# Altium project PIN_CubeSat.PrjPCB (part 2 of 2)

## Sheet CAN_transceiver.SchDoc
size A3; Organization: Altium Limited; Address1: L3, 12a Rodborough Rd; Address2: Frenchs Forest; Address3: NSW; Address4: Australia 2086
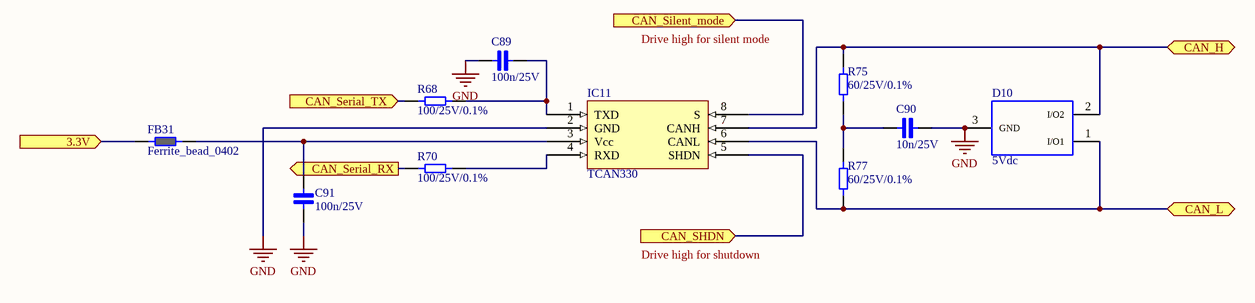
[diagram p11: CAN_transceiver.SchDoc]

### Parts
C89  100n/25V  [Cap_0402]
C90  10n/25V  [Cap_0402]
C91  100n/25V  [Cap_0402]
D10  5Vdc  [WE-TVS_SOT23-3L]
FB31  Ferrite_bead_0402  [FERRITE_0402]
IC11  TCAN330  [SOIC8]
R68  100/25V/0.1%  [RES_0402]
R70  100/25V/0.1%  [RES_0402]
R75  60/25V/0.1%  [RES_1206]
R77  60/25V/0.1%  [RES_1206]

### Ports
3.3V (in), CAN_H (bidir), CAN_L (bidir), CAN_Serial_RX (out), CAN_Serial_TX (in), CAN_SHDN (in), CAN_Silent_mode (in)

### Nets
GND: C89.1 C90.2 C91.1 D10.3(GND) IC11.2(GND)
3.3V: FB31.1 ; port 3.3V
CAN_H: D10.2(I/O2) IC11.7(CANH) R75.2 ; port CAN_H
CAN_L: D10.1(I/O1) IC11.6(CANL) R77.1 ; port CAN_L
CAN_Serial_RX: R70.1 ; port CAN_Serial_RX
CAN_Serial_TX: R68.1 ; port CAN_Serial_TX
CAN_SHDN: IC11.5(SHDN) ; port CAN_SHDN
CAN_Silent_mode: IC11.8(S) ; port CAN_Silent_mode
NetC89_2: C89.2 IC11.1(TXD) R68.2
NetC90_1: C90.1 R75.1 R77.2
NetC91_2: C91.2 FB31.2 IC11.3(Vcc)
NetIC11_4: IC11.4(RXD) R70.2

### Notes on the sheet
- Drive high for silent mode
- Drive high for shutdown
- Title
- Size:
- Date:
- A3
- Number:
- Time:
- Revision:
- Sheet
- of
- File:

### Library data of the parts
C89 C91 = Cap_0402_100n: as C3 on sheet Preamplifier; ComponentLink1Description: New link; ComponentLink1URL: https://www.we-online.com/catalog/en/WCAP-CSGP-25VDC
C90 = Cap_0402_10n: as C32 on sheet General_design; ComponentLink1Description: New link; ComponentLink1URL: https://www.we-online.com/catalog/en/WCAP-CSGP-25VDC
D10 = 824022: WE-TVS TVS Diode - Standard Series, SOT23-3L, 2Channel, 5Vdc; Manufacturer: Wurth Elektronik; Reverse Breakdown Voltage min.: 6.1V; Channel: 2; Channel Input Capacitance: 12pF; Reverse Peak Pulse Current: 8A; Reverse Channel Leakage Current: 2.5uA; DC Operating Voltage: 5V; ComponentLink1Description: Manufacturer; ComponentLink1URL: http://www.we-online.de; ComponentLink2Description: Datasheet; ComponentLink2URL: https://www.we-online.com/catalog/datasheet/824022.pdf; Manufacturer Part Number: 824022; Published Date: April 2020; Size: SOT23-3L; Operating Temperature: -55 to +125degC; Mounting Technology: SMT; Packaging: Tape and Reel
FB31 = Ferrite_bead_0402: Ferrite bead, wurth 74269241102
IC11 = TCAN330: CAN transceiver, 3,3V
R68 R70 = Res_0402_100: Vishay, thin film resistor 100/25V/0.1%
R75 R77 = Res_1206_60: Vishay, thin film resistor 60/25V/0.1%

## Sheet MRAM.SchDoc
size A3; Organization: Altium Limited; Address1: L3, 12a Rodborough Rd; Address2: Frenchs Forest; Address3: NSW; Address4: Australia 2086
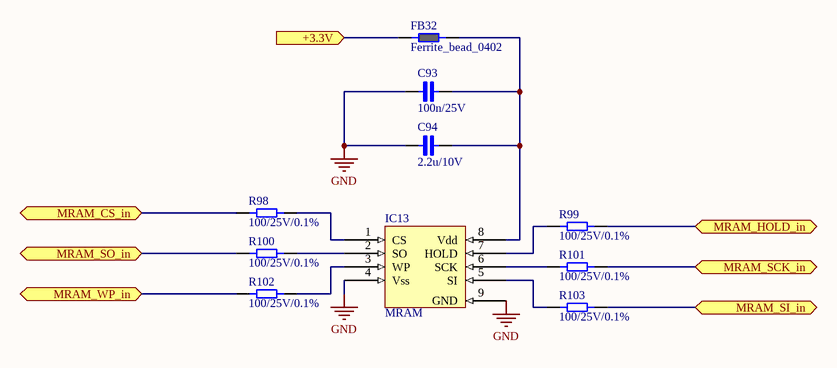
[diagram p12: MRAM.SchDoc]

### Parts
C93  100n/25V  [Cap_0402]
C94  2.2u/10V  [CAP_0603]
FB32  Ferrite_bead_0402  [FERRITE_0402]
IC13  MRAM  [DFN8]
R98  100/25V/0.1%  [RES_0402]
R99  100/25V/0.1%  [RES_0402]
R100  100/25V/0.1%  [RES_0402]
R101  100/25V/0.1%  [RES_0402]
R102  100/25V/0.1%  [RES_0402]
R103  100/25V/0.1%  [RES_0402]

### Ports
+3.3V (in), MRAM_CS_in (bidir), MRAM_HOLD_in (bidir), MRAM_SCK_in (bidir), MRAM_SI_in (bidir), MRAM_SO_in (bidir), MRAM_WP_in (bidir)

### Nets
3.3V: FB32.1 ; port +3.3V
GND: C93.1 C94.1 IC13.4(Vss) IC13.9(GND)
MRAM_CS: R98.1 ; port MRAM_CS_in
MRAM_HOLD: R99.2 ; port MRAM_HOLD_in
MRAM_SCK: R101.2 ; port MRAM_SCK_in
MRAM_SI: R103.2 ; port MRAM_SI_in
MRAM_SO: R100.1 ; port MRAM_SO_in
MRAM_WP: R102.1 ; port MRAM_WP_in
NetC93_2: C93.2 C94.2 FB32.2 IC13.8(Vdd)
NetIC13_1: IC13.1(CS) R98.2
NetIC13_2: IC13.2(SO) R100.2
NetIC13_3: IC13.3(WP) R102.2
NetIC13_5: IC13.5(SI) R103.1
NetIC13_6: IC13.6(SCK) R101.1
NetIC13_7: IC13.7(HOLD) R99.1

### Notes on the sheet
- Title
- Size:
- Date:
- A3
- Number:
- Time:
- Revision:
- Sheet
- of
- File:

### Library data of the parts
C93 = Cap_0402_100n: as C3 on sheet Preamplifier; ComponentLink1Description: New link; ComponentLink1URL: https://www.we-online.com/catalog/en/WCAP-CSGP-25VDC
C94 = Cap_0603_2.2u: Ceramic Capacitor 2.2uF / 0603 / 10V / ±5%, Wurth Elektronik MLCC
FB32 = Ferrite_bead_0402: Ferrite bead, wurth 74269241102
IC13 = MR25H128A: MRAM, 128Kb Serial SPI MRAM, EVERPIN technologies; ComponentLink1Description: New link; ComponentLink1URL: https://pl.mouser.com/datasheet/2/144/MR25H128A_Datasheet-1219034.pdf
R98-R103 = Res_0402_100: Vishay, thin film resistor 100/25V/0.1%

## Sheet LCL_pin_bias.SchDoc
size A3; Organization: Altium Limited; Address1: L3, 12a Rodborough Rd; Address2: Frenchs Forest; Address3: NSW; Address4: Australia 2086
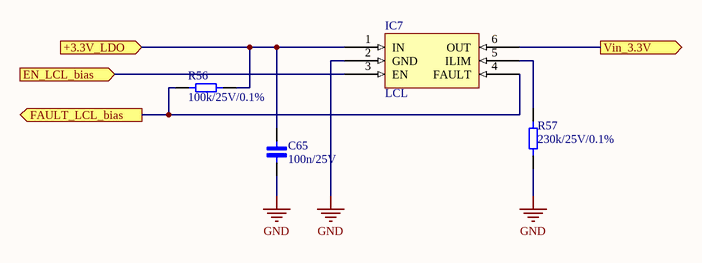
[diagram p13: LCL_pin_bias.SchDoc]

### Parts
C65  100n/25V  [Cap_0402]
IC7  LCL  [SOT-23-6]
R56  100k/25V/0.1%  [RES_0402]
R57  230k/25V/0.1%  [RES_0402]

### Ports
+3.3V_LDO (in), EN_LCL_bias (in), FAULT_LCL_bias (out), Vin_3.3V (out)

### Nets
GND: C65.1 IC7.2(GND) R57.1
+3.3V_LDO: C65.2 IC7.1(IN) R56.1 ; port +3.3V_LDO
EN_LCL_bias: IC7.3(EN) ; port EN_LCL_bias
FAULT_LCL_bias: IC7.4(FAULT) R56.2 ; port FAULT_LCL_bias
Vin_3.3V: IC7.6(OUT) ; port Vin_3.3V
NetIC7_5: IC7.5(ILIM) R57.2

### Notes on the sheet
- Title
- Size:
- Date:
- A3
- Number:
- Time:
- Revision:
- Sheet
- of
- File:

### Library data of the parts
C65 = Cap_0402_100n: as C3 on sheet Preamplifier; ComponentLink1Description: New link; ComponentLink1URL: https://www.we-online.com/catalog/en/WCAP-CSGP-25VDC
IC7 = TPS2553: Latch-off Current Limiter; ComponentLink1Description: New link; ComponentLink1URL: https://www.ti.com/lit/ds/symlink/tps2553.pdf?ts=1603819295065&ref_url=https%253A%252F%252Fwww.google.com%252F
R56 = Res_0402_100k: Vishay, thin film resistor 100k/25V/0.1%
R57 = Res_0402_230k: Vishay, thin film resistor 230k/25V/0.1%

## Sheet prec_5V_LDO.SchDoc
size A3; Organization: Altium Limited; Address1: L3, 12a Rodborough Rd; Address2: Frenchs Forest; Address3: NSW; Address4: Australia 2086
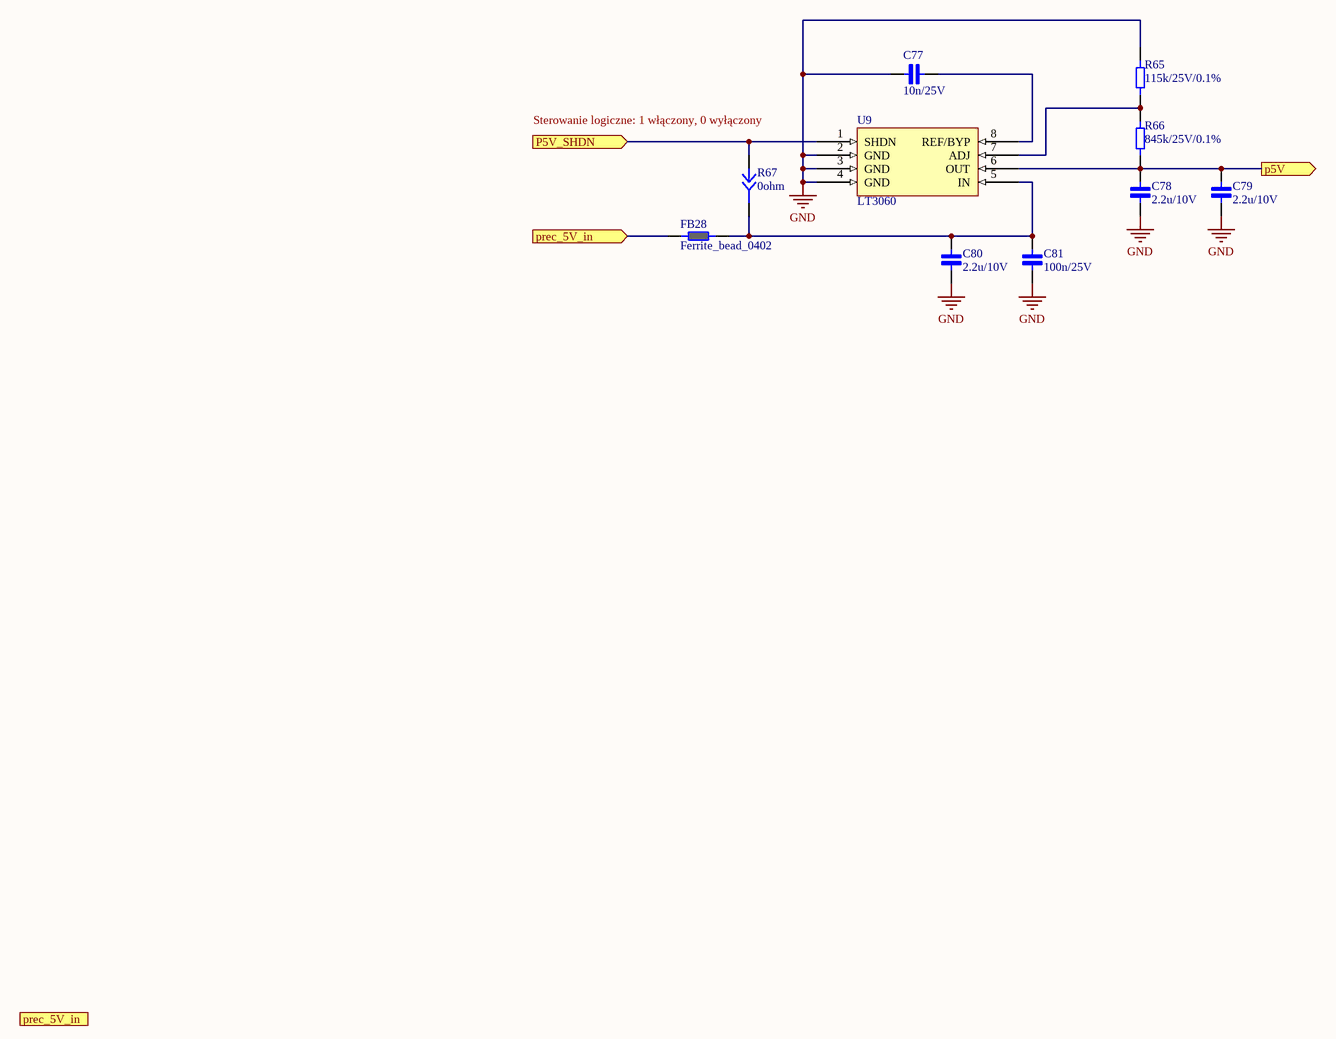
[diagram p14: prec_5V_LDO.SchDoc]

### Parts
(Parts that share a designator on the sheet are numbered #1, #2 ... from top to bottom, then left to right.)
C77  10n/25V  [Cap_0402]
C78  2.2u/10V  [Cap_0402]
C79  2.2u/10V  [Cap_0402]
C80  2.2u/10V  [Cap_0402]
C81  100n/25V  [Cap_0402]
FB28  Ferrite_bead_0402  [FERRITE_0402]
R65  115k/25V/0.1%  [RES_0402]
R66  845k/25V/0.1%  [RES_0402]
R67#1  0ohm  [Jumper 2]
U9  LT3060  [TS8]

### Ports
p5V (out), P5V_SHDN (in), prec_5V_in (in), prec_5V_in (out)

### Nets
GND: C77.2 C78.1 C79.1 C80.1 C81.1 R65.2 U9.2(GND) U9.3(GND) U9.4(GND)
p5V: C78.2 C79.2 R66.1 U9.6(OUT) ; port p5V
P5V_SHDN: R67#1.2 U9.1(SHDN) ; port P5V_SHDN
prec_5V_in: FB28.1 ; port prec_5V_in
NetC77_1: C77.1 U9.8(REF/BYP)
NetC80_2: C80.2 C81.2 FB28.2 R67#1.2 U9.5(IN)
NetR65_1: R65.1 R66.2 U9.7(ADJ)

### Notes on the sheet
- Sterowanie logiczne: 1 włączony, 0 wyłączony
- Title
- Size:
- Date:
- A3
- Number:
- Time:
- Revision:
- Sheet
- of
- File:

### Library data of the parts
C77 = Cap_0402_10n: as C32 on sheet General_design; ComponentLink1Description: New link; ComponentLink1URL: https://www.we-online.com/catalog/en/WCAP-CSGP-25VDC
C78-C80 = Cap_0402_2.2u: Ceramic Capacitor 2.2uF / 0402 / 10V / ±5%, Wurth Elektronik MLCC
C81 = Cap_0402_100n: as C3 on sheet Preamplifier; ComponentLink1Description: New link; ComponentLink1URL: https://www.we-online.com/catalog/en/WCAP-CSGP-25VDC
FB28 = Ferrite_bead_0402: Ferrite bead, wurth 74269241102
R65 = Res_0402_115k: Vishay, thin film resistor 115k/25V/0.1%
R66 = Res_0402_845k: Vishay, thin film resistor 845k/25V/0.1%
R67#1 = Jumper
U9 = Lt3060: 45V VIN, Micropower, / Low Noise, 100mA Low / Dropout, Linear Regulator

## Sheet LCL_12V_prec.SchDoc
size A3; Organization: Altium Limited; Address1: L3, 12a Rodborough Rd; Address2: Frenchs Forest; Address3: NSW; Address4: Australia 2086
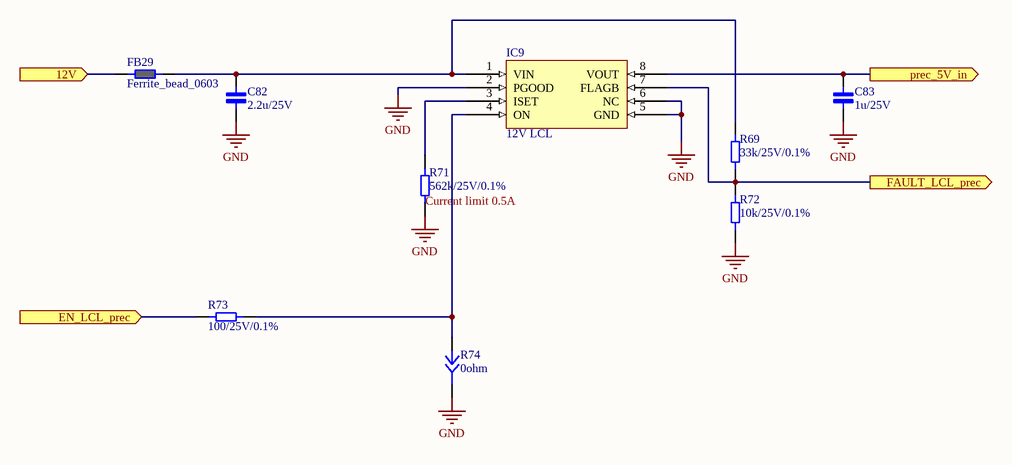
[diagram p15: LCL_12V_prec.SchDoc]

### Parts
(Parts that share a designator on the sheet are numbered #1, #2 ... from top to bottom, then left to right.)
C82  2.2u/25V  [CAP_0603]
C83  1u/25V  [CAP_0603]
FB29  Ferrite_bead_0603  [Ferrite_0603]
IC9  12V LCL  [SO8]
R69  33k/25V/0.1%  [RES_0402]
R71  562k/25V/0.1%  [RES_0402]
R72  10k/25V/0.1%  [RES_0402]
R73  100/25V/0.1%  [RES_0402]
R74#1  0ohm  [Jumper 2]

### Ports
12V (in), EN_LCL_prec (in), FAULT_LCL_prec (out), prec_5V_in (out)

### Nets
12V: FB29.1 ; port 12V
GND: C82.1 C83.1 IC9.2(PGOOD) IC9.5(GND) IC9.6(NC) R71.1 R72.1 R74#1.2
EN_LCL_prec: R73.1 ; port EN_LCL_prec
FAULT_LCL_prec: IC9.7(FLAGB) R69.1 R72.2 ; port FAULT_LCL_prec
prec_5V_in: C83.2 IC9.8(VOUT) ; port prec_5V_in
NetC82_2: C82.2 FB29.2 IC9.1(VIN) R69.2
NetIC9_3: IC9.3(ISET) R71.2
NetIC9_4: IC9.4(ON) R73.2 R74#1.2

### Notes on the sheet
- (near R71) Current limit 0.5A
- Title
- Size:
- Date:
- A3
- Number:
- Time:
- Revision:
- Sheet
- of
- File:

### Library data of the parts
C82 = Cap_0603_2.2u_25v: Ceramic Capacitor 2.2uF / 0603 / 25V / ±5%, Wurth Elektronik MLCC
C83 = Cap_0603_1u_25v: Ceramic Capacitor 1uF / 0603 / 25V / ±5%, Wurth Elektronik MLCC
FB29 = Ferrite_bead_0603: Ferrite bead
IC9 = FPF2700: FPF270xMX
R69 = Res_0402_33k: Vishay, thin film resistor 33k/25V/0.1%
R71 = Res_0402_562k: Vishay, thin film resistor 562k/25V/0.1%
R72 = Res_0402_10k: Vishay, thin film resistor 10k/25V/0.1%
R73 = Res_0402_100: Vishay, thin film resistor 100/25V/0.1%
R74#1 = Jumper

## Sheet LCL_12V_chp.SchDoc
size A3; Organization: Altium Limited; Address1: L3, 12a Rodborough Rd; Address2: Frenchs Forest; Address3: NSW; Address4: Australia 2086
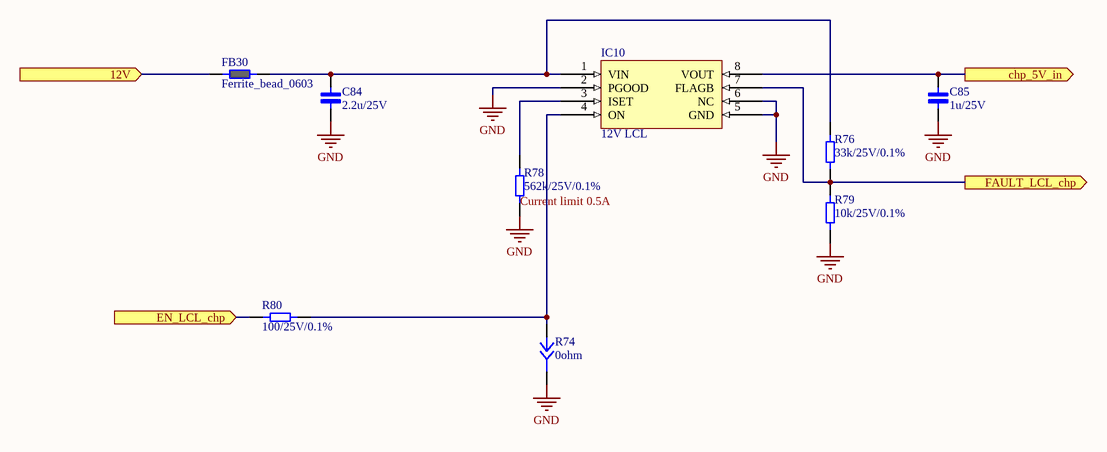
[diagram p16: LCL_12V_chp.SchDoc]

### Parts
(Parts that share a designator on the sheet are numbered #1, #2 ... from top to bottom, then left to right.)
C84  2.2u/25V  [CAP_0603]
C85  1u/25V  [CAP_0603]
FB30  Ferrite_bead_0603  [Ferrite_0603]
IC10  12V LCL  [SO8]
R74#2  0ohm  [Jumper 2]
R76  33k/25V/0.1%  [RES_0402]
R78  562k/25V/0.1%  [RES_0402]
R79  10k/25V/0.1%  [RES_0402]
R80  100/25V/0.1%  [RES_0402]

### Ports
12V (in), chp_5V_in (out), EN_LCL_chp (in), FAULT_LCL_chp (out)

### Nets
12V: FB30.1 ; port 12V
GND: C84.1 C85.1 IC10.2(PGOOD) IC10.5(GND) IC10.6(NC) R74#2.2 R78.1 R79.1
CHP_5V_in: C85.2 IC10.8(VOUT) ; port chp_5V_in
EN_LCL_chp: R80.2 ; port EN_LCL_chp
FAULT_LCL_chp: IC10.7(FLAGB) R76.1 R79.2 ; port FAULT_LCL_chp
NetC84_2: C84.2 FB30.2 IC10.1(VIN) R76.2
NetIC10_3: IC10.3(ISET) R78.2
NetIC10_4: IC10.4(ON) R74#2.1 R80.1

### Notes on the sheet
- (near R78) Current limit 0.5A
- Title
- Size:
- Date:
- A3
- Number:
- Time:
- Revision:
- Sheet
- of
- File:

### Library data of the parts
C84 = Cap_0603_2.2u_25v: as C82 on sheet LCL_12V_prec
C85 = Cap_0603_1u_25v: as C83 on sheet LCL_12V_prec
FB30 = Ferrite_bead_0603: Ferrite bead
IC10 = FPF2700: FPF270xMX
R74#2 = Mini jumper
R76 = Res_0402_33k: Vishay, thin film resistor 33k/25V/0.1%
R78 = Res_0402_562k: Vishay, thin film resistor 562k/25V/0.1%
R79 = Res_0402_10k: Vishay, thin film resistor 10k/25V/0.1%
R80 = Res_0402_100: Vishay, thin film resistor 100/25V/0.1%

## Sheet Dual_signal_switch.SchDoc
size A3; Organization: Altium Limited; Address1: L3, 12a Rodborough Rd; Address2: Frenchs Forest; Address3: NSW; Address4: Australia 2086
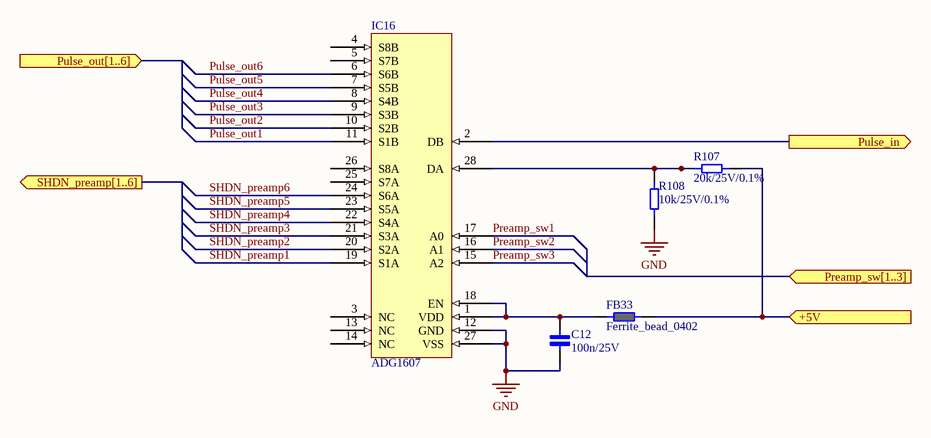
[diagram p17: Dual_signal_switch.SchDoc]

### Parts
C12  100n/25V  [Cap_0402]
FB33  Ferrite_bead_0402  [FERRITE_0402]
IC16  ADG1607  [TSOP28]
R107  20k/25V/0.1%  [RES_0402]
R108  10k/25V/0.1%  [RES_0402]

### Ports
+5V (in), Preamp_sw[1..3] (in), Pulse_in (out), Pulse_out[1..6] (in), SHDN_preamp[1..6] (out)

### Nets
+5: FB33.2 R107.2 ; port +5V
GND: C12.1 IC16.12(GND) IC16.27(VSS) R108.1
Preamp_sw1: IC16.17(A0)
Preamp_sw2: IC16.16(A1)
Preamp_sw3: IC16.15(A2)
Pulse_in: IC16.2(DB) ; port Pulse_in
Pulse_out1: IC16.11(S1B)
Pulse_out2: IC16.10(S2B)
Pulse_out3: IC16.9(S3B)
Pulse_out4: IC16.8(S4B)
Pulse_out5: IC16.7(S5B)
Pulse_out6: IC16.6(S6B)
SHDN_preamp1: IC16.19(S1A)
SHDN_preamp2: IC16.20(S2A)
SHDN_preamp3: IC16.21(S3A)
SHDN_preamp4: IC16.22(S4A)
SHDN_preamp5: IC16.23(S5A)
SHDN_preamp6: IC16.24(S6A)
NetC12_2: C12.2 FB33.1 IC16.1(VDD) IC16.18(EN)
NetIC16_28: IC16.28(DA) R107.1 R108.2

Not connected (* = marked no-connect by the designer): IC16 3(NC) 4(S8B) 5(S7B) 13(NC) 14(NC) 25(S7A) 26(S8A)

### Notes on the sheet
- Title
- Size:
- Date:
- A3
- Number:
- Time:
- Revision:
- Sheet
- of
- File:

### Library data of the parts
C12 = Cap_0402_100n: as C3 on sheet Preamplifier; ComponentLink1Description: New link; ComponentLink1URL: https://www.we-online.com/catalog/en/WCAP-CSGP-25VDC
FB33 = Ferrite_bead_0402: Ferrite bead, wurth 74269241102
IC16 = ADG1607: 8-ch MUX; ComponentLink1Description: New link; ComponentLink1URL: https://pl.mouser.com/datasheet/2/609/ADG1606_1607-1502923.pdf
R107 = Res_0402_20k: Vishay, thin film resistor 20k/25V/0.1%
R108 = Res_0402_10k: Vishay, thin film resistor 10k/25V/0.1%

## Sheet MCU_LDO.SchDoc
size A3; Organization: Altium Limited; Address1: L3, 12a Rodborough Rd; Address2: Frenchs Forest; Address3: NSW; Address4: Australia 2086
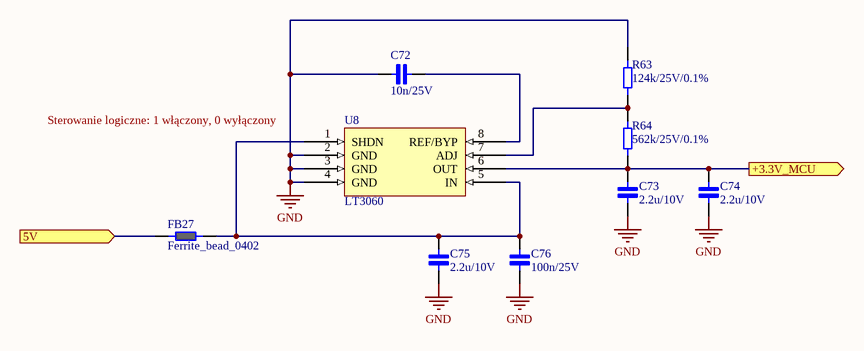
[diagram p18: MCU_LDO.SchDoc]

### Parts
C72  10n/25V  [Cap_0402]
C73  2.2u/10V  [Cap_0402]
C74  2.2u/10V  [Cap_0402]
C75  2.2u/10V  [Cap_0402]
C76  100n/25V  [Cap_0402]
FB27  Ferrite_bead_0402  [FERRITE_0402]
R63  124k/25V/0.1%  [RES_0402]
R64  562k/25V/0.1%  [RES_0402]
U8  LT3060  [TS8]

### Ports
5V (in), +3.3V_MCU (out)

### Nets
3.3V: C73.2 C74.2 R64.1 U8.6(OUT) ; port +3.3V_MCU
5V: FB27.1 ; port 5V
GND: C72.1 C73.1 C74.1 C75.1 C76.1 R63.2 U8.2(GND) U8.3(GND) U8.4(GND)
NetC72_2: C72.2 U8.8(REF/BYP)
NetC75_2: C75.2 C76.2 FB27.2 U8.1(SHDN) U8.5(IN)
NetR63_1: R63.1 R64.2 U8.7(ADJ)

### Notes on the sheet
- (near U8) Sterowanie logiczne: 1 włączony, 0 wyłączony
- Title
- Size:
- Date:
- A3
- Number:
- Time:
- Revision:
- Sheet
- of
- File:

### Library data of the parts
C72 = Cap_0402_10n: as C32 on sheet General_design; ComponentLink1Description: New link; ComponentLink1URL: https://www.we-online.com/catalog/en/WCAP-CSGP-25VDC
C73-C75 = Cap_0402_2.2u: as C78 on sheet prec_5V_LDO
C76 = Cap_0402_100n: as C3 on sheet Preamplifier; ComponentLink1Description: New link; ComponentLink1URL: https://www.we-online.com/catalog/en/WCAP-CSGP-25VDC
FB27 = Ferrite_bead_0402: Ferrite bead, wurth 74269241102
R63 = Res_0402_124k: Vishay, thin film resistor 124k/25V/0.1%
R64 = Res_0402_562k: Vishay, thin film resistor 562k/25V/0.1%
U8 = Lt3060: as U9 on sheet prec_5V_LDO

## Sheet LCL_CAN.SchDoc
size A3; Organization: Altium Limited; Address1: L3, 12a Rodborough Rd; Address2: Frenchs Forest; Address3: NSW; Address4: Australia 2086
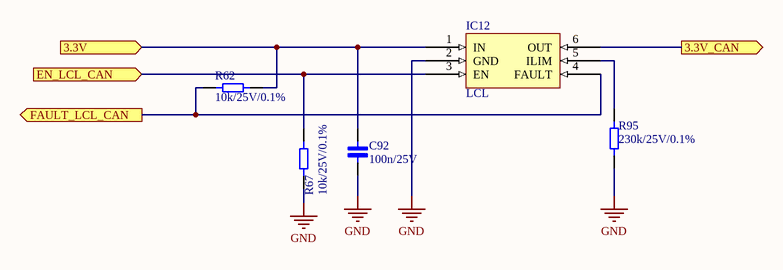
[diagram p19: LCL_CAN.SchDoc]

### Parts
(Parts that share a designator on the sheet are numbered #1, #2 ... from top to bottom, then left to right.)
C92  100n/25V  [Cap_0402]
IC12  LCL  [SOT-23-6]
R62#2  10k/25V/0.1%  [RES_0402]
R67#2  10k/25V/0.1%  [RES_0402]
R95  230k/25V/0.1%  [RES_0402]

### Ports
3.3V (in), 3.3V_CAN (out), EN_LCL_CAN (in), FAULT_LCL_CAN (out)

### Nets
3.3V: C92.2 IC12.1(IN) R62#2.2 ; port 3.3V
GND: C92.1 IC12.2(GND) R67#2.1 R95.1
3.3V_CAN: IC12.6(OUT) ; port 3.3V_CAN
EN_LCL_CAN: IC12.3(EN) R67#2.2 ; port EN_LCL_CAN
FAULT_LCL_CAN: IC12.4(FAULT) R62#2.1 ; port FAULT_LCL_CAN
NetIC12_5: IC12.5(ILIM) R95.2

### Notes on the sheet
- Title
- Size:
- Date:
- A3
- Number:
- Time:
- Revision:
- Sheet
- of
- File:

### Library data of the parts
C92 = Cap_0402_100n: Ceramic Capacitor 100n / 0402 / 25V / ±5%, Wurth Elektronik MLCC; ComponentLink1Description: New link; ComponentLink1URL: https://www.we-online.com/catalog/en/WCAP-CSGP-25VDC
IC12 = TPS2553: Latch-off Current Limiter; ComponentLink1Description: New link; ComponentLink1URL: https://www.ti.com/lit/ds/symlink/tps2553.pdf?ts=1603819295065&ref_url=https%253A%252F%252Fwww.google.com%252F
R62#2 R67#2 = Res_0402_10k: Vishay, thin film resistor 10k/25V/0.1%
R95 = Res_0402_230k: Vishay, thin film resistor 230k/25V/0.1%

## Sheet LCL_SYM_5V.SchDoc
size A3; Organization: Altium Limited; Address1: L3, 12a Rodborough Rd; Address2: Frenchs Forest; Address3: NSW; Address4: Australia 2086
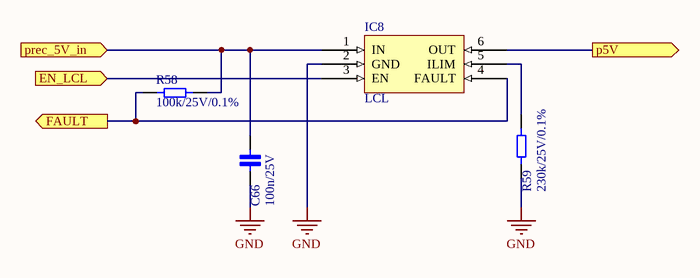
[diagram p20: LCL_SYM_5V.SchDoc]

### Parts
C66  100n/25V  [CAP_0603]
IC8  LCL  [SOT-23-6]
R58  100k/25V/0.1%  [RES_0603]
R59  230k/25V/0.1%  [RES_0603]

### Ports
EN_LCL (in), FAULT (out), p5V (out), prec_5V_in (in)

### Nets
GND: C66.1 IC8.2(GND) R59.2
EN_LCL: IC8.3(EN) ; port EN_LCL
FAULT: IC8.4(FAULT) R58.1 ; port FAULT
p5V: IC8.6(OUT) ; port p5V
prec_5V_in: C66.2 IC8.1(IN) R58.2 ; port prec_5V_in
NetIC8_5: IC8.5(ILIM) R59.2

### Notes on the sheet
- Title
- Size:
- Date:
- A3
- Number:
- Time:
- Revision:
- Sheet
- of
- File:

### Library data of the parts
C66 = Cap_0603_100n: Ceramic Capacitor 100n / 0603 / 25V / ±5%, Wurth Elektronik MLCC; ComponentLink1Description: New link; ComponentLink1URL: https://www.we-online.com/catalog/en/WCAP-CSGP-25VDC
IC8 = TPS2553: Latch-off Current Limiter; ComponentLink1Description: New link; ComponentLink1URL: https://www.ti.com/lit/ds/symlink/tps2553.pdf?ts=1603819295065&ref_url=https%253A%252F%252Fwww.google.com%252F
R58 = Res_0603_100k: Vishay, thin film resistor 100k/25V/0.1%
R59 = Res_0603_230k: Vishay, thin film resistor 230k/25V/0.1%

## Sheet Signal_switch.SchDoc
size A3; Organization: Altium Limited; Address1: L3, 12a Rodborough Rd; Address2: Frenchs Forest; Address3: NSW; Address4: Australia 2086
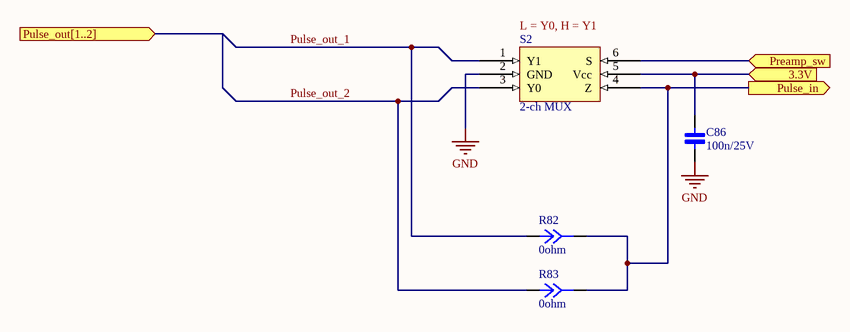
[diagram p21: Signal_switch.SchDoc]

### Parts
C86  100n/25V  [CAP_0603]
R82  0ohm  [Jumper]
R83  0ohm  [Jumper]
S2  2-ch MUX  [TSOP6]

### Ports
3.3V (in), Preamp_sw (in), Pulse_in (out), Pulse_out[1..2] (in)

### Nets
GND: C86.1 S2.2(GND)
3.3V: C86.2 S2.5(Vcc) ; port 3.3V
Preamp_sw: S2.6(S) ; port Preamp_sw
Pulse_in: R82.2 R83.2 S2.4(Z) ; port Pulse_in
Pulse_out_1: R82.2 S2.1(Y1)
Pulse_out_2: R83.2 S2.3(Y0)

### Notes on the sheet
- (near S2) L = Y0, H = Y1
- Title
- Size:
- Date:
- A3
- Number:
- Time:
- Revision:
- Sheet
- of
- File:

### Library data of the parts
C86 = Cap_0603_100n: as C66 on sheet LCL_SYM_5V; ComponentLink1Description: New link; ComponentLink1URL: https://www.we-online.com/catalog/en/WCAP-CSGP-25VDC
R82 R83 = Jumper
S2 = 74LVC1G3157-Q100: 2-channel analog multiplexer/demultiplexernexperia

## Sheet Preamplifier_switch.SchDoc
size A3; Organization: Altium Limited; Address1: L3, 12a Rodborough Rd; Address2: Frenchs Forest; Address3: NSW; Address4: Australia 2086
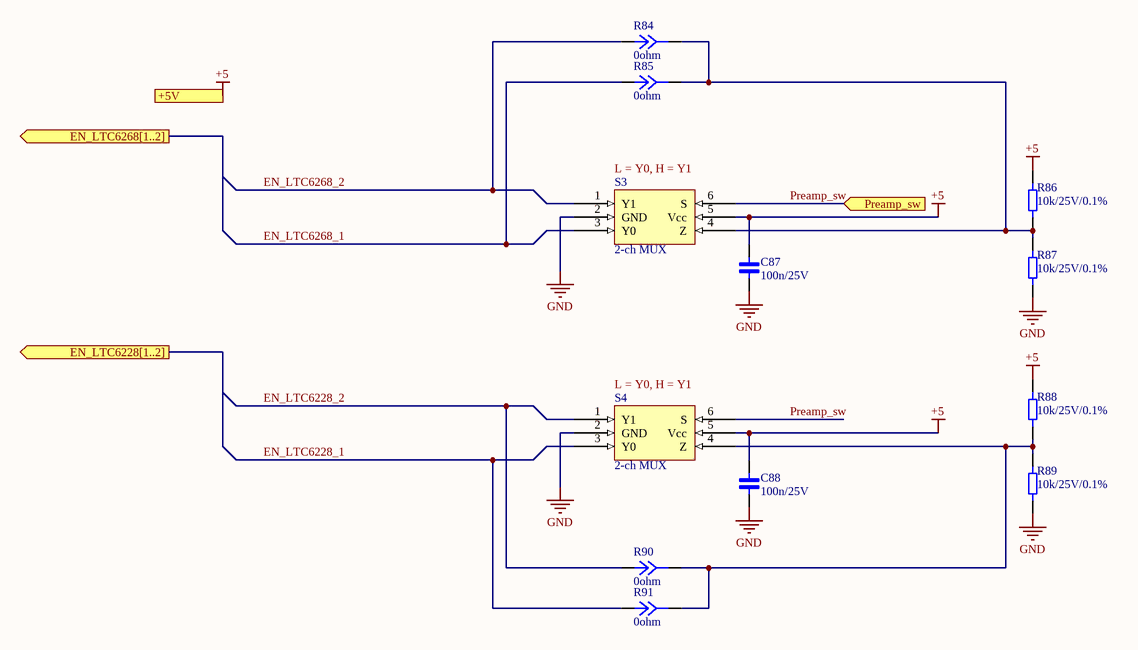
[diagram p22: Preamplifier_switch.SchDoc]

### Parts
C87  100n/25V  [CAP_0603]
C88  100n/25V  [CAP_0603]
R84  0ohm  [Jumper]
R85  0ohm  [Jumper]
R86  10k/25V/0.1%  [RES_0603]
R87  10k/25V/0.1%  [RES_0603]
R88  10k/25V/0.1%  [RES_0603]
R89  10k/25V/0.1%  [RES_0603]
R90  0ohm  [Jumper]
R91  0ohm  [Jumper]
S3  2-ch MUX  [TSOP6]
S4  2-ch MUX  [TSOP6]

### Ports
+5V (in), EN_LTC6228[1..2] (out), EN_LTC6268[1..2] (out), Preamp_sw (in)

### Nets
+5: C87.2 C88.2 R86.2 R88.2 S3.5(Vcc) S4.5(Vcc) ; port +5V
GND: C87.1 C88.1 R87.2 R89.2 S3.2(GND) S4.2(GND)
EN_LTC6228_1: R91.2 S4.3(Y0)
EN_LTC6228_2: R90.2 S4.1(Y1)
EN_LTC6268_1: R85.2 S3.3(Y0)
EN_LTC6268_2: R84.2 S3.1(Y1)
Preamp_sw: S3.6(S) S4.6(S) ; port Preamp_sw
NetR84_2: R84.2 R85.2 R86.2 R87.2 S3.4(Z)
NetR88_2: R88.2 R89.2 R90.2 R91.2 S4.4(Z)

### Notes on the sheet
- (near S3) L = Y0, H = Y1
- (near S4) L = Y0, H = Y1
- Title
- Size:
- Date:
- A3
- Number:
- Time:
- Revision:
- Sheet
- of
- File:

### Library data of the parts
C87 C88 = Cap_0603_100n: as C66 on sheet LCL_SYM_5V; ComponentLink1Description: New link; ComponentLink1URL: https://www.we-online.com/catalog/en/WCAP-CSGP-25VDC
R84 R85 R90 R91 = Jumper
R86-R89 = Res_0603_10k: Vishay, thin film resistor 10k/25V/0.1%
S3 S4 = 74LVC1G3157-Q100: as S2 on sheet Signal_switch

## Sheet Temp_sensors.SchDoc
size A3; Organization: Altium Limited; Address1: L3, 12a Rodborough Rd; Address2: Frenchs Forest; Address3: NSW; Address4: Australia 2086
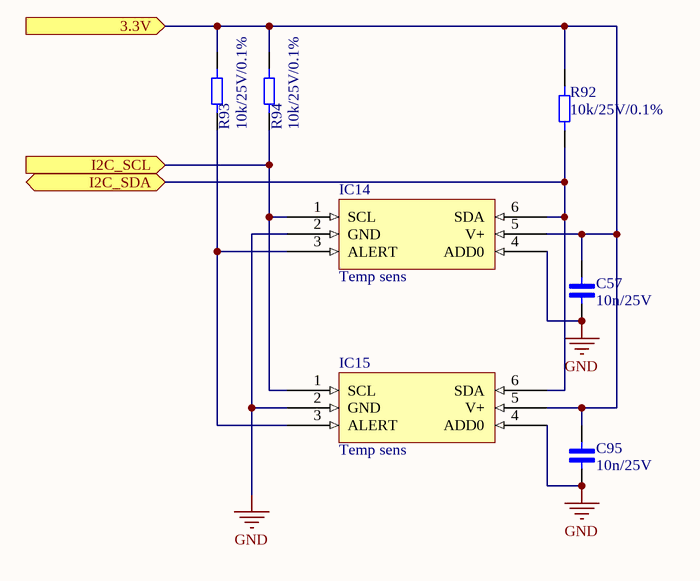
[diagram p23: Temp_sensors.SchDoc]

### Parts
(Parts that share a designator on the sheet are numbered #1, #2 ... from top to bottom, then left to right.)
C57#2  10n/25V  [Cap_0402]
C95  10n/25V  [Cap_0402]
IC14  Temp sens  [SOT563]
IC15  Temp sens  [SOT563]
R92  10k/25V/0.1%  [RES_0402]
R93  10k/25V/0.1%  [RES_0402]
R94  10k/25V/0.1%  [RES_0402]

### Ports
3.3V (in), I2C_SCL (in), I2C_SDA (bidir)

### Nets
GND: C57#2.1 C95.1 IC14.2(GND) IC14.4(ADD0) IC15.2(GND) IC15.4(ADD0)
3.3V: C57#2.2 C95.2 IC14.5(V+) IC15.5(V+) R92.2 R93.2 R94.2 ; port 3.3V
I2C_SCL: IC14.1(SCL) IC15.1(SCL) R94.1 ; port I2C_SCL
I2C_SDA: IC14.6(SDA) IC15.6(SDA) R92.1 ; port I2C_SDA
NetIC14_3: IC14.3(ALERT) IC15.3(ALERT) R93.1

### Notes on the sheet
- Title
- Size:
- Date:
- A3
- Number:
- Time:
- Revision:
- Sheet
- of
- File:

### Library data of the parts
C57#2 C95 = Cap_0402_10n: Ceramic Capacitor 10n / 0402 / 25V / ±5%, Wurth Elektronik MLCC; ComponentLink1Description: New link; ComponentLink1URL: https://www.we-online.com/catalog/en/WCAP-CSGP-25VDC
IC14 IC15 = TMP102-Q1: Temperature sensor, TMP102-Q1 Low-Power Digital Temperature Sensor With SMBus / and Two-Wire Serial Interface in SOT563; ComponentLink1Description: New link; ComponentLink1URL: https://www.ti.com/lit/ds/symlink/tmp102-q1.pdf?ts=1605094603566&ref_url=https%253A%252F%252Fwww.ti.com%252Fproduct%252FTMP102-Q1
R92-R94 = Res_0402_10k: Vishay, thin film resistor 10k/25V/0.1%

## Sheet MCU_48pin.SchDoc
size A3; Organization: Altium Limited; Address1: L3, 12a Rodborough Rd; Address2: Frenchs Forest; Address3: NSW; Address4: Australia 2086
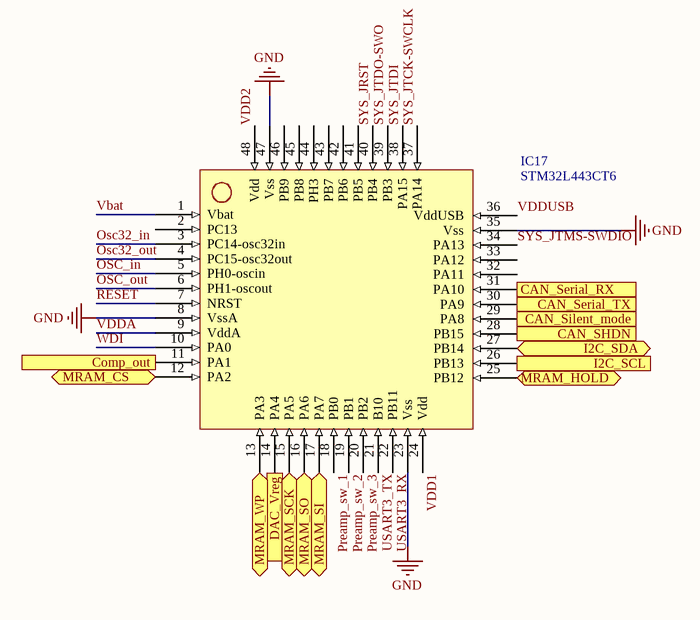
[diagram p24: MCU_48pin.SchDoc]

### Parts
IC17  STM32L443CT6  [LQFP48]

### Ports
CAN_Serial_RX (in), CAN_Serial_TX (out), CAN_SHDN (out), CAN_Silent_mode (out), Comp_out (in), DAC_Vreg (out), I2C_SCL (out), I2C_SDA (bidir), MRAM_CS (bidir), MRAM_HOLD (bidir), MRAM_SCK (bidir), MRAM_SI (bidir), MRAM_SO (bidir), MRAM_WP (bidir)

### Nets
GND: IC17.8(VssA) IC17.23(Vss) IC17.35(Vss) IC17.47(Vss)
CAN_Serial_RX: IC17.31(PA10) ; port CAN_Serial_RX
CAN_Serial_TX: IC17.30(PA9) ; port CAN_Serial_TX
CAN_SHDN: IC17.28(PB15) ; port CAN_SHDN
CAN_Silent_mode: IC17.29(PA8) ; port CAN_Silent_mode
Comp_out: IC17.11(PA1) ; port Comp_out
DAC_Vreg: IC17.14(PA4) ; port DAC_Vreg
I2C_SCL: IC17.26(PB13) ; port I2C_SCL
I2C_SDA: IC17.27(PB14) ; port I2C_SDA
MRAM_CS: IC17.12(PA2) ; port MRAM_CS
MRAM_HOLD: IC17.25(PB12) ; port MRAM_HOLD
MRAM_SCK: IC17.15(PA5) ; port MRAM_SCK
MRAM_SI: IC17.17(PA7) ; port MRAM_SI
MRAM_SO: IC17.16(PA6) ; port MRAM_SO
MRAM_WP: IC17.13(PA3) ; port MRAM_WP
Osc32_in: IC17.3(PC14-osc32in)
Osc32_out: IC17.4(PC15-osc32out)
OSC_in: IC17.5(PH0-oscin)
OSC_out: IC17.6(PH1-oscout)
Preamp_sw_1: IC17.18(PB0)
Preamp_sw_2: IC17.19(PB1)
Preamp_sw_3: IC17.20(PB2)
RESET: IC17.7(NRST)
SYS_JRST: IC17.40(PB4)
SYS_JTCK-SWCLK: IC17.37(PA14)
SYS_JTDI: IC17.38(PA15)
SYS_JTDO-SWO: IC17.39(PB3)
SYS_JTMS-SWDIO: IC17.34(PA13)
USART3_RX: IC17.22(PB11)
USART3_TX: IC17.21(B10)
Vbat: IC17.1(Vbat)
VDD1: IC17.24(Vdd)
VDD2: IC17.48(Vdd)
VDDA: IC17.9(VddA)
VDDUSB: IC17.36(VddUSB)
WDI: IC17.10(PA0)

Not connected (* = marked no-connect by the designer): IC17 2(PC13) 32(PA11) 33(PA12) 41(PB5) 42(PB6) 43(PB7) 44(PH3) 45(PB8) 46(PB9)

### Notes on the sheet
- Title
- Size:
- Date:
- A3
- Number:
- Time:
- Revision:
- Sheet
- of
- File:

### Library data of the parts
IC17 = STM32L443CT: Microcontroller STM32; ComponentLink1Description: New link; ComponentLink1URL: https://il.farnell.com/stmicroelectronics/stm32l443cct6/mcu-32bit-80mhz-lqfp-48/dp/3129670

## Nets that join several sheets
3.3V: MCU (9 pins), MRAM (FB32.1), MCU_LDO (C73.2 C74.2 R64.1 U8.6), LCL_CAN (C92.2 IC12.1 R62#2.2)
5V: Customer_Module-APS_Connector (X1.35), prec_3V_LDO (FB26.1), MCU_LDO (FB27.1)
12V: Customer_Module-APS_Connector (X1.34), LCL_12V_prec (FB29.1), LCL_12V_chp (FB30.1)
+5: Preamplifier1 (FB2_Preamplifier1.2 FB4_Preamplifier1.2 FB6_Preamplifier1.1), Preamplifier2 (FB2_Preamplifier2.2 FB4_Preamplifier2.2 FB6_Preamplifier2.1), Preamplifier3 (FB2_Preamplifier3.2 FB4_Preamplifier3.2 FB6_Preamplifier3.1), Preamplifier4 (FB2_Preamplifier4.2 FB4_Preamplifier4.2 FB6_Preamplifier4.1), Preamplifier5 (FB2_Preamplifier5.2 FB4_Preamplifier5.2 FB6_Preamplifier5.1), Preamplifier6 (FB2_Preamplifier6.2 FB4_Preamplifier6.2 FB6_Preamplifier6.1), Comparator (FB20.2 FB21.2 FB22.2), Symmetric_PS (C58.2 IC6.12 R51.2), Dual_signal_switch (FB33.2 R107.2), Preamplifier_switch (6 pins)
-5: PIN_Diode1 (FB15_PIN_Diode1.1), PIN_Diode2 (FB15_PIN_Diode2.1), PIN_Diode3 (FB15_PIN_Diode3.1), PIN_Diode4 (FB15_PIN_Diode4.1), PIN_Diode5 (FB15_PIN_Diode5.1), PIN_Diode6 (FB15_PIN_Diode6.1), Preamplifier1 (FB3_Preamplifier1.1), Preamplifier2 (FB3_Preamplifier2.1), Preamplifier3 (FB3_Preamplifier3.1), Preamplifier4 (FB3_Preamplifier4.1), Preamplifier5 (FB3_Preamplifier5.1), Preamplifier6 (FB3_Preamplifier6.1), Comparator (FB23.1 FB24.2 FB34.1 FB35.1), Symmetric_PS (C63.1 IC6.5 R55.1)
GND: General_design (11 pins), Preamplifier1 (18 pins), Preamplifier2 (18 pins), Preamplifier3 (18 pins), Preamplifier4 (18 pins), Preamplifier5 (18 pins), Preamplifier6 (18 pins), PIN_bias_voltage (17 pins), MCU (30 pins), Customer_Module-Main_Connector (25 pins), Customer_Module-APS_Connector (18 pins), Comparator (21 pins), Symmetric_PS (11 pins), prec_3V_LDO (9 pins), CAN_transceiver (5 pins), MRAM (C93.1 C94.1 IC13.4 IC13.9), LCL_pin_bias (C65.1 IC7.2 R57.1), prec_5V_LDO (9 pins), LCL_12V_prec (8 pins), LCL_12V_chp (8 pins), Dual_signal_switch (C12.1 IC16.12 IC16.27 R108.1), MCU_LDO (9 pins), LCL_CAN (C92.1 IC12.2 R67#2.1 R95.1), LCL_SYM_5V (C66.1 IC8.2 R59.2), Signal_switch (C86.1 S2.2), Preamplifier_switch (6 pins), Temp_sensors (6 pins), MCU_48pin (IC17.8 IC17.23 IC17.35 IC17.47)
p5V: Preamplifier1 (FB1_Preamplifier1.2 FB5_Preamplifier1.2), Preamplifier2 (FB1_Preamplifier2.2 FB5_Preamplifier2.2), Preamplifier3 (FB1_Preamplifier3.2 FB5_Preamplifier3.2), Preamplifier4 (FB1_Preamplifier4.2 FB5_Preamplifier4.2), Preamplifier5 (FB1_Preamplifier5.2 FB5_Preamplifier5.2), Preamplifier6 (FB1_Preamplifier6.2 FB5_Preamplifier6.2), prec_5V_LDO (C78.2 C79.2 R66.1 U9.6)
+3.3V_LDO: prec_3V_LDO (C68.2 C69.2 R61.1 U7.6), LCL_pin_bias (C65.2 IC7.1 R56.1)
+60V: PIN_Diode1 (FB14_PIN_Diode1.1), PIN_Diode2 (FB14_PIN_Diode2.1), PIN_Diode3 (FB14_PIN_Diode3.1), PIN_Diode4 (FB14_PIN_Diode4.1), PIN_Diode5 (FB14_PIN_Diode5.1), PIN_Diode6 (FB14_PIN_Diode6.1), PIN_bias_voltage (C17.2 IC3.5)
CAN_H: Customer_Module-Main_Connector (X2.25), CAN_transceiver (D10.2 IC11.7 R75.2)
CAN_L: Customer_Module-Main_Connector (X2.24), CAN_transceiver (D10.1 IC11.6 R77.1)
CAN_Serial_RX: MCU (IC4.70), CAN_transceiver (R70.1)
CAN_Serial_TX: MCU (IC4.71), CAN_transceiver (R68.1)
CAN_SHDN: MCU (IC4.67), CAN_transceiver (IC11.5)
CAN_Silent_mode: MCU (IC4.66), CAN_transceiver (IC11.8)
CHP_5V_in: Symmetric_PS (FB25.1), LCL_12V_chp (C85.2 IC10.8)
CHP_EN: MCU (IC4.38), Symmetric_PS (IC6.1 IC6.13)
Comp_out: MCU (IC4.17), Comparator (R50.2 U.7)
DAC_Vreg: PIN_bias_voltage (R19.2), MCU (IC4.29)
EN_bias: PIN_bias_voltage (IC3.13), MCU (IC4.52)
EN_LCL_bias: MCU (IC4.53), LCL_pin_bias (IC7.3)
EN_LCL_CAN: MCU (IC4.62), LCL_CAN (IC12.3 R67#2.2)
EN_LCL_chp: MCU (IC4.39), LCL_12V_chp (R80.2)
EN_LCL_prec: MCU (IC4.58), LCL_12V_prec (R73.1)
FAULT_LCL_bias: MCU (IC4.54), LCL_pin_bias (IC7.4 R56.2)
FAULT_LCL_CAN: MCU (IC4.61), LCL_CAN (IC12.4 R62#2.1)
FAULT_LCL_chp: MCU (IC4.40), LCL_12V_chp (IC10.7 R76.1 R79.2)
FAULT_LCL_prec: MCU (IC4.59), LCL_12V_prec (IC9.7 R69.1 R72.2)
Manual_reset: MCU (R31.1), Customer_Module-Main_Connector (R29.1)
MRAM_CS: MCU (IC4.63), MRAM (R98.1)
MRAM_HOLD: MCU (IC4.65), MRAM (R99.2)
MRAM_SCK: MCU (IC4.78), MRAM (R101.2)
MRAM_SI: MCU (IC4.80), MRAM (R103.2)
MRAM_SO: MCU (IC4.79), MRAM (R100.1)
MRAM_WP: MCU (IC4.64), MRAM (R102.1)
p3V_SHDN: MCU (IC4.57), prec_3V_LDO (R62#1.2 U7.1)
P5V_SHDN: MCU (IC4.60), prec_5V_LDO (R67#1.2 U9.1)
prec_5V_in: prec_5V_LDO (FB28.1), LCL_12V_prec (C83.2 IC9.8)
Pulse_in: Comparator (R36.2), Dual_signal_switch (IC16.2)
SYS_JRST: MCU (D8.3 IC4.90), Customer_Module-Main_Connector (X2.36)
SYS_JTCK-SWCLK: MCU (D8.5 IC4.76), Customer_Module-Main_Connector (X2.67)
SYS_JTDI: MCU (D8.4 IC4.77), Customer_Module-Main_Connector (X2.66)
SYS_JTDO-SWO: MCU (D8.1 IC4.89), Customer_Module-Main_Connector (X2.35)
SYS_JTMS-SWDIO: MCU (D8.6 IC4.72), Customer_Module-Main_Connector (X2.34)
USART3_RX: MCU (D9.1 IC4.56), Customer_Module-Main_Connector (R33.1)
USART3_TX: MCU (D9.2 IC4.55), Customer_Module-Main_Connector (R30.1)
Vin_3.3V: PIN_bias_voltage (FB7.1 FB8.1), LCL_pin_bias (IC7.6)